# EAGLE schematic garbage2_unrouted (EAGLE 5.06)
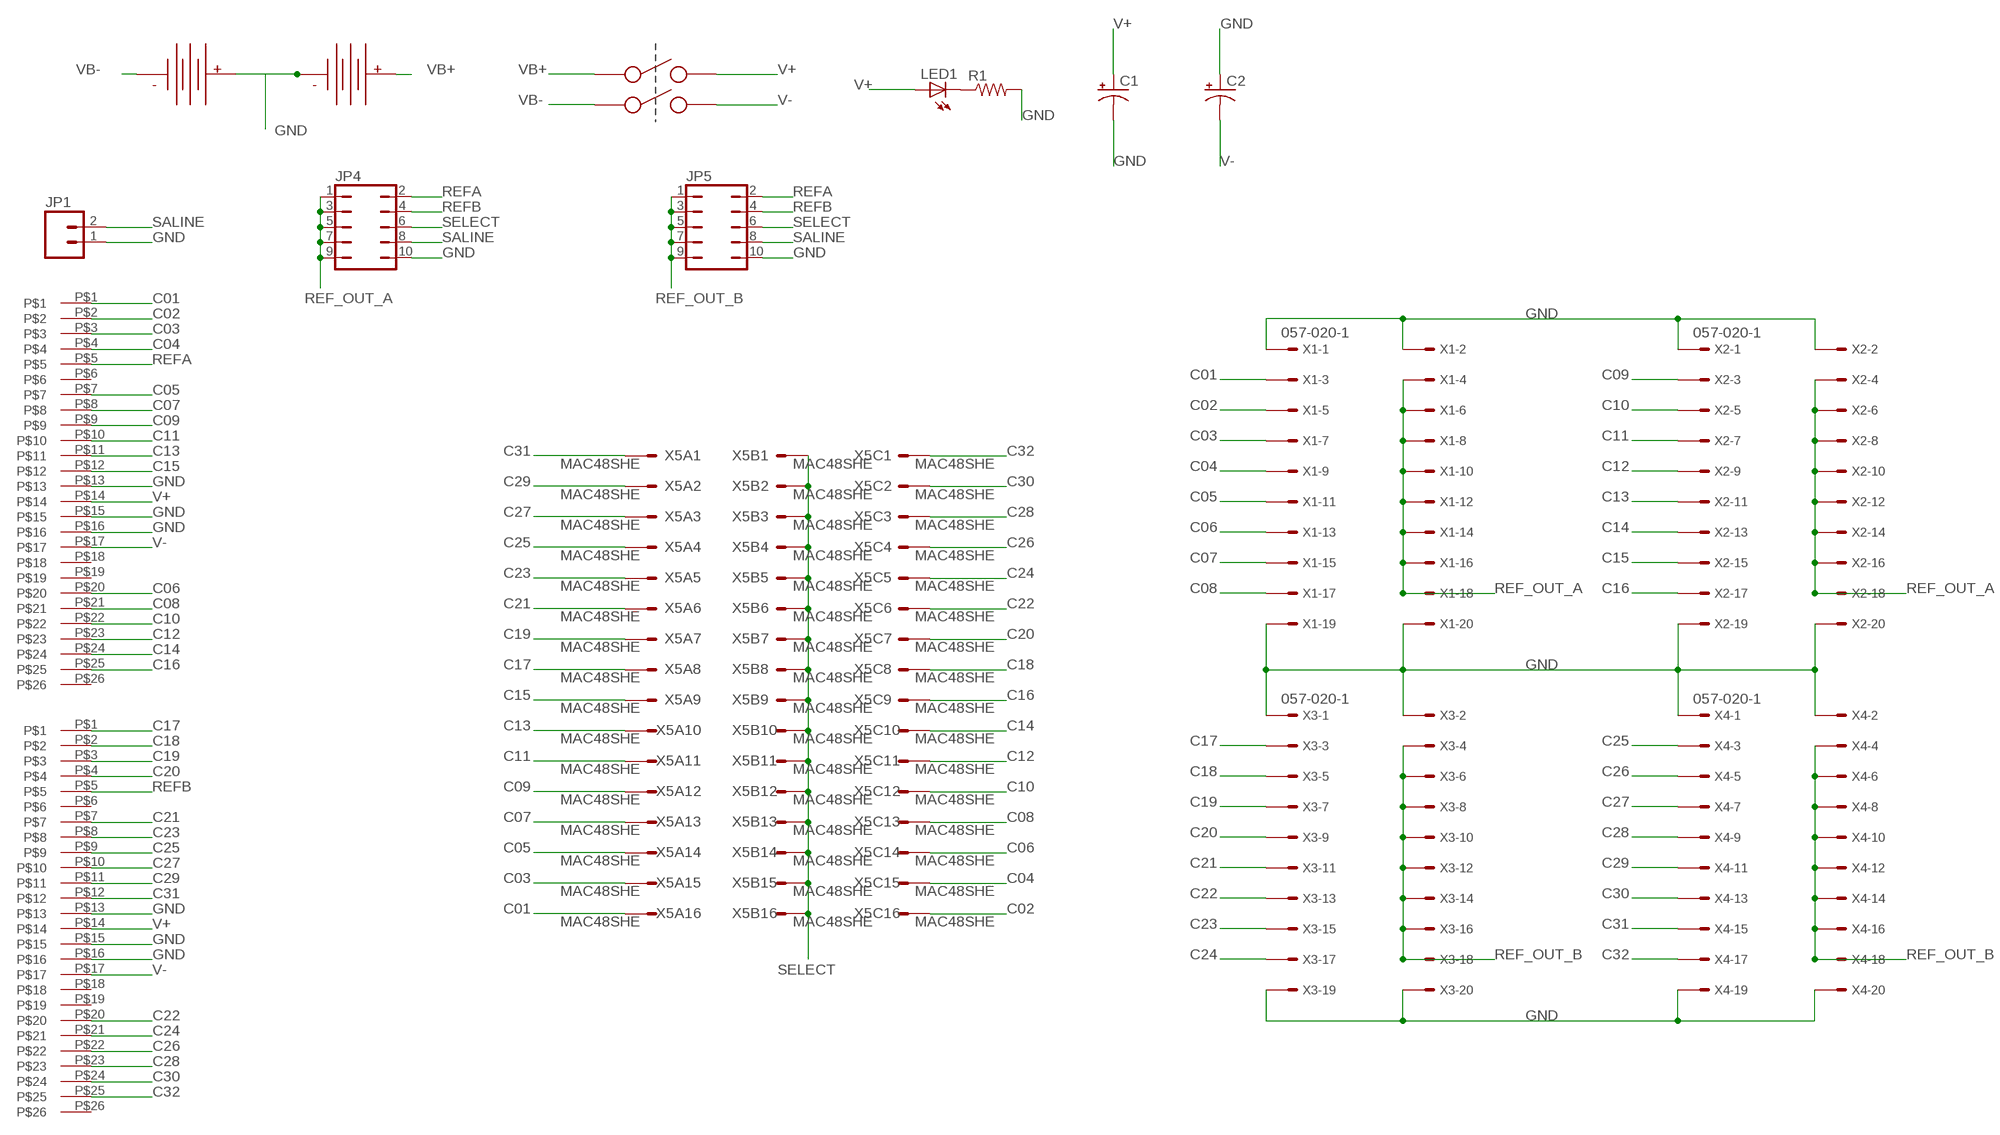
[diagram p0: schematic, sheet 1]

## Parts
BANKA  MINI-DB26TYCO1761028-1  [MINI-DB26]
C1  CPOL-USE2.5-6  [E2,5-6]
C2  CPOL-USE2.5-6  [E2,5-6]
JP1  M02LOCK  [1X02_LOCK]
JP4  JP5Q  [JP5Q]
JP5  JP5Q  [JP5Q]
LED1  LED5MM  [LED5MM]
R1  R-US_0207/10  [0207/10]
U$1  AA-BAT-BHAA-3BHAA-3  [AA-BAT-BHAA-3]
U$2  AA-BAT-BHAA-3BHAA-3  [AA-BAT-BHAA-3]
U$3  MINI-DB26TYCO1761028-1  [MINI-DB26]
U$5  SWITCH-DPST-S201031MS02QDPST  [SWITCH-DPST-S201031MS02Q]
X1  057-020-1  [057-020-1]
X2  057-020-1  [057-020-1]
X3  057-020-1  [057-020-1]
X4  057-020-1  [057-020-1]
X5  MAC48SHE  [MAC48SH]

## Nets
C01: BANKA.P$1 X1.3 X5.A16
C02: BANKA.P$2 X1.5 X5.C16
C03: BANKA.P$3 X1.7 X5.A15
C04: BANKA.P$4 X1.9 X5.C15
C05: BANKA.P$7 X1.11 X5.A14
C06: BANKA.P$20 X1.13 X5.C14
C07: BANKA.P$8 X1.15 X5.A13
C08: BANKA.P$21 X1.17 X5.C13
C09: BANKA.P$9 X2.3 X5.A12
C10: BANKA.P$22 X2.5 X5.C12
C11: BANKA.P$10 X2.7 X5.A11
C12: BANKA.P$23 X2.9 X5.C11
C13: BANKA.P$11 X2.11 X5.A10
C14: BANKA.P$24 X2.13 X5.C10
C15: BANKA.P$12 X2.15 X5.A9
C16: BANKA.P$25 X2.17 X5.C9
C17: U$3.P$1 X3.3 X5.A8
C18: U$3.P$2 X3.5 X5.C8
C19: U$3.P$3 X3.7 X5.A7
C20: U$3.P$4 X3.9 X5.C7
C21: U$3.P$7 X3.11 X5.A6
C22: U$3.P$20 X3.13 X5.C6
C23: U$3.P$8 X3.15 X5.A5
C24: U$3.P$21 X3.17 X5.C5
C25: U$3.P$9 X4.3 X5.A4
C26: U$3.P$22 X4.5 X5.C4
C27: U$3.P$10 X4.7 X5.A3
C28: U$3.P$23 X4.9 X5.C3
C29: U$3.P$11 X4.11 X5.A2
C30: U$3.P$24 X4.13 X5.C2
C31: U$3.P$12 X4.15 X5.A1
C32: U$3.P$25 X4.17 X5.C1
GND: BANKA.P$13 BANKA.P$15 BANKA.P$16 C1.- C2.+ JP1.1 JP4.10 JP5.10 R1.2 U$1.POS U$2.NEG U$3.P$13 U$3.P$15 U$3.P$16 X1.1 X1.2 X1.19 X1.20 X2.1 X2.2 X2.19 X2.20 X3.1 X3.2 X3.19 X3.20 X4.1 X4.2 X4.19 X4.20
N$1: LED1.K(C) R1.1
REF_OUT_A: JP4.1 JP4.3 JP4.5 JP4.7 JP4.9 X1.4 X1.6 X1.8 X1.10 X1.12 X1.14 X1.16 X1.18 X2.4 X2.6 X2.8 X2.10 X2.12 X2.14 X2.16 X2.18
REF_OUT_B: JP5.1 JP5.3 JP5.5 JP5.7 JP5.9 X3.4 X3.6 X3.8 X3.10 X3.12 X3.14 X3.16 X3.18 X4.4 X4.6 X4.8 X4.10 X4.12 X4.14 X4.16 X4.18
REFA: BANKA.P$5 JP4.2 JP5.2
REFB: JP4.4 JP5.4 U$3.P$5
SALINE: JP1.2 JP4.8 JP5.8
SELECT: JP4.6 JP5.6 X5.B1 X5.B2 X5.B3 X5.B4 X5.B5 X5.B6 X5.B7 X5.B8 X5.B9 X5.B10 X5.B11 X5.B12 X5.B13 X5.B14 X5.B15 X5.B16
V+: BANKA.P$14 C1.+ LED1.A U$3.P$14 U$5.PIN2
V-: BANKA.P$17 C2.- U$3.P$17 U$5.PIN5
VB+: U$2.POS U$5.PIN1
VB-: U$1.NEG U$5.PIN4
Unconnected: BANKA.P$6 BANKA.P$18 BANKA.P$19 BANKA.P$26 U$3.P$6 U$3.P$18 U$3.P$19 U$3.P$26

## Library data of the parts
BANKA U$3 = coxlab:MINI-DB26
C1 C2 = resistor:CPOL-US: POLARIZED CAPACITOR, American symbol
JP1 = SparkFun:M02: Header 2 Standard 2-pin 0.1" header. Use with straight break away headers (SKU : PRT-00116), right angle break away headers (PRT-00553), swiss pins (PRT-00743), machine pins (PRT-00117), and female headers (PRT-00115). Molex polarized connector foot print use with SKU : PRT-08233 with associated crimp pins and housings.
JP4 JP5 = jumper:JP5Q: JUMPER
LED1 = led:LED: LED OSRAM: - CHIPLED LG R971, LG N971, LY N971, LG Q971, LY Q971, LO R971, LY R971 LH N974, LH R974 LS Q976, LO Q976, LY Q976 LO Q996 - Hyper CHIPLED LW Q18S LB Q993, LB Q99A, LB R99A - SideLED LS A670, LO A670, LY A670, LG A670, LP A670 LB A673, LV A673, LT A673, LW A673 LH A674 LY A675 LS A676, LA A676, LO A676, LY A676, LW A676 LS A679, LY A679, LG A679 - Hyper Micro SIDELED® LS Y876, LA Y876, LO Y876, LY Y876 LT Y87S - SmartLED LW L88C, LW L88S LB L89C, LB L89S, LG L890 LS L89K, LO L89K, LY L89K LS L896, LA L896, LO L896, LY L896 - TOPLED LS T670, LO T670, LY T670, LG T670, LP T670 LSG T670, LSP T670, LSY T670, LOP T670, LYG T670 LG T671, LOG T671, LSG T671 LB T673, LV T673, LT T673, LW T673 LH T674 LS T676, LA T676, LO T676, LY T676, LB T676, LH T676, LSB T676, LW T676 LB T67C, LV T67C, LT T67C, LS T67K, LO T67K, LY T67K, LW E67C LS E67B, LA E67B, LO E67B, LY E67B, LB E67C, LV E67C, LT E67C LW T67C LS T679, LY T679, LG T679 LS T770, LO T770, LY T770, LG T770, LP T770 LB T773, LV T773, LT T773, LW T773 LH T774 LS E675, LA E675, LY E675, LS T675 LS T776, LA T776, LO T776, LY T776, LB T776 LHGB T686 LT T68C, LB T68C - Hyper Mini TOPLED® LB M676 - Mini TOPLED Santana® LG M470 LS M47K, LO M47K, LY M47K Source: http://www.osram.convergy.de LUXEON: - LUMILED® LXK2-PW12-R00, LXK2-PW12-S00, LXK2-PW14-U00, LXK2-PW14-V00 LXK2-PM12-R00, LXK2-PM12-S00, LXK2-PM14-U00 LXK2-PE12-Q00, LXK2-PE12-R00, LXK2-PE12-S00, LXK2-PE14-T00, LXK2-PE14-U00 LXK2-PB12-K00, LXK2-PB12-L00, LXK2-PB12-M00, LXK2-PB14-N00, LXK2-PB14-P00, LXK2-PB14-Q00 LXK2-PR12-L00, LXK2-PR12-M00, LXK2-PR14-Q00, LXK2-PR14-R00 LXK2-PD12-Q00, LXK2-PD12-R00, LXK2-PD12-S00 LXK2-PH12-R00, LXK2-PH12-S00 LXK2-PL12-P00, LXK2-PL12-Q00, LXK2-PL12-R00 Source: www.luxeon.com KINGBRIGHT: KA-3528ASYC Source: www.kingbright.com
R1 = resistor:R-US_: RESISTOR, American symbol
U$1 U$2 = coxlab:AA-BAT-BHAA-3: PCB mount AA battery holder
U$5 = coxlab:SWITCH-DPST-S201031MS02Q
X1-X4 = con-panduit:057-020-: CONNECTOR 20-pin series 057 contact pc board low profile headers
X5 = con-vg:MAC48SHE: CONNECTOR male, 48 pins, single, type C/2, rows ABC, grid 2.54 mm